# EAGLE design Discrete Datalogger ECU rev1 (EAGLE 8.6.0)
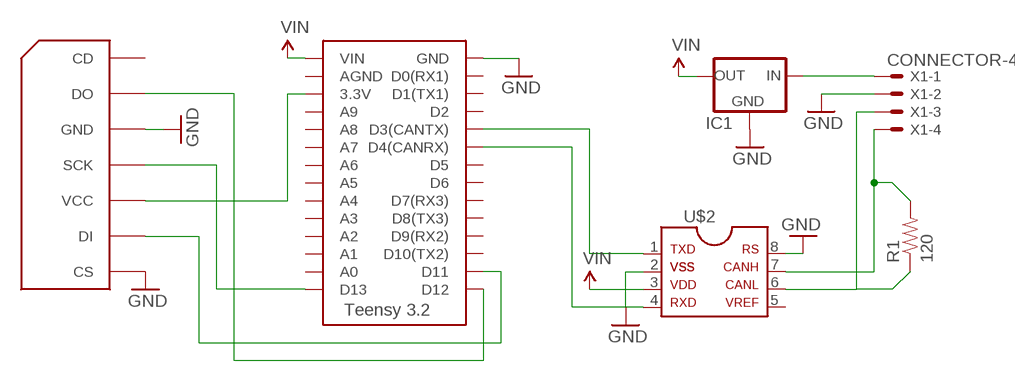
[diagram p0: schematic, sheet 1]

## Parts
IC1  5VREG_L7805_VERT  [TO-220]
R1  120  RESISTORAXIAL-0.3  [AXIAL-0.3]
U$1  TEENSY_3.2_SIMPLE  [TEENSY_3.2_SIMPLE]
U$2  MCP2551DIL  [DIL08]
U$3  SDCARD_INTERFACE  [SDCARD_INTERFACE]
X1  CONNECTOR-4  [MINIFIT_5566-4]

## Nets
GND: IC1.2(GND) U$1.GND U$2.2 U$2.8 U$3.CS U$3.GND X1.2
N$1: IC1.1(IN) X1.1
N$2: R1.P$2 U$2.7 X1.4
N$3: R1.P$1 U$2.6 X1.3
N$4: U$1.D3(CANTX) U$2.1
N$5: U$1.D4(CANRX) U$2.4
N$6: U$1.D13 U$3.SCK
N$7: U$1.D11 U$3.DI
N$8: U$1.3.3V U$3.VCC
N$9: U$1.D12 U$3.DO
VIN: IC1.3(OUT) U$1.VIN U$2.3
Unconnected: U$1.A0 U$1.A1 U$1.A2 U$1.A3 U$1.A4 U$1.A5 U$1.A6 U$1.A7 U$1.A8 U$1.A9 U$1.AGND U$1.D0(RX1) U$1.D1(TX1) U$1.D2 U$1.D5 U$1.D6 U$1.D7(RX3) U$1.D8(TX3) U$1.D9(RX2) U$1.D10(TX2) U$2.5 U$3.CD

## Library data of the parts
IC1 = HyTechDevices:5VREG_L7805: Voltage Regulator Switching 5v regulator Datasheet <http://power.murata.com/data/power/oki-78sr.pdf> Standard 7805 5V regulator. IGO (Input Ground Output). Spark Fun Electronics SKU : COM-00107 Datasheet <http://www.mouser.com/ds/2/308/MC7800-D-94905.pdf>
R1 = HyTechDevices:RESISTOR: Resistor Basic schematic elements and footprints for 0603, 1206, and PTH resistors.
U$1 = HyTechDevices:TEENSY_3.2_SIMPLE: Simple version of the Teensy 3.2 board that only uses the 2 main rows of pins, not the inner pins or the pins opposite the usb port.
U$2 = HyTechDevices:MCP2551: MCP2551 High-Speed CAN Transceiver Product Webpage <https://www.microchip.com/wwwproducts/en/MCP2551> Datasheet <http://ww1.microchip.com/downloads/en/DeviceDoc/21667f.pdf> This device is outdated It is replaced by MCP2561. Comparison Page <https://www.microchip.com/wwwproducts/ProductCompare/MCP2551/MCP2561> Product Webpage <https://www.microchip.com/wwwproducts/en/MCP2561> Datasheet <http://ww1.microchip.com/downloads/en/DeviceDoc/20005167C.pdf>
U$3 = HyTechDevices:SDCARD_INTERFACE
X1 = HyTechDevices:CONNECTOR-4: Mini-Fit Junior connector 4 pole Source: http://www.molex.com; OC_FARNELL: unknown; OC_NEWARK: unknown

## Board
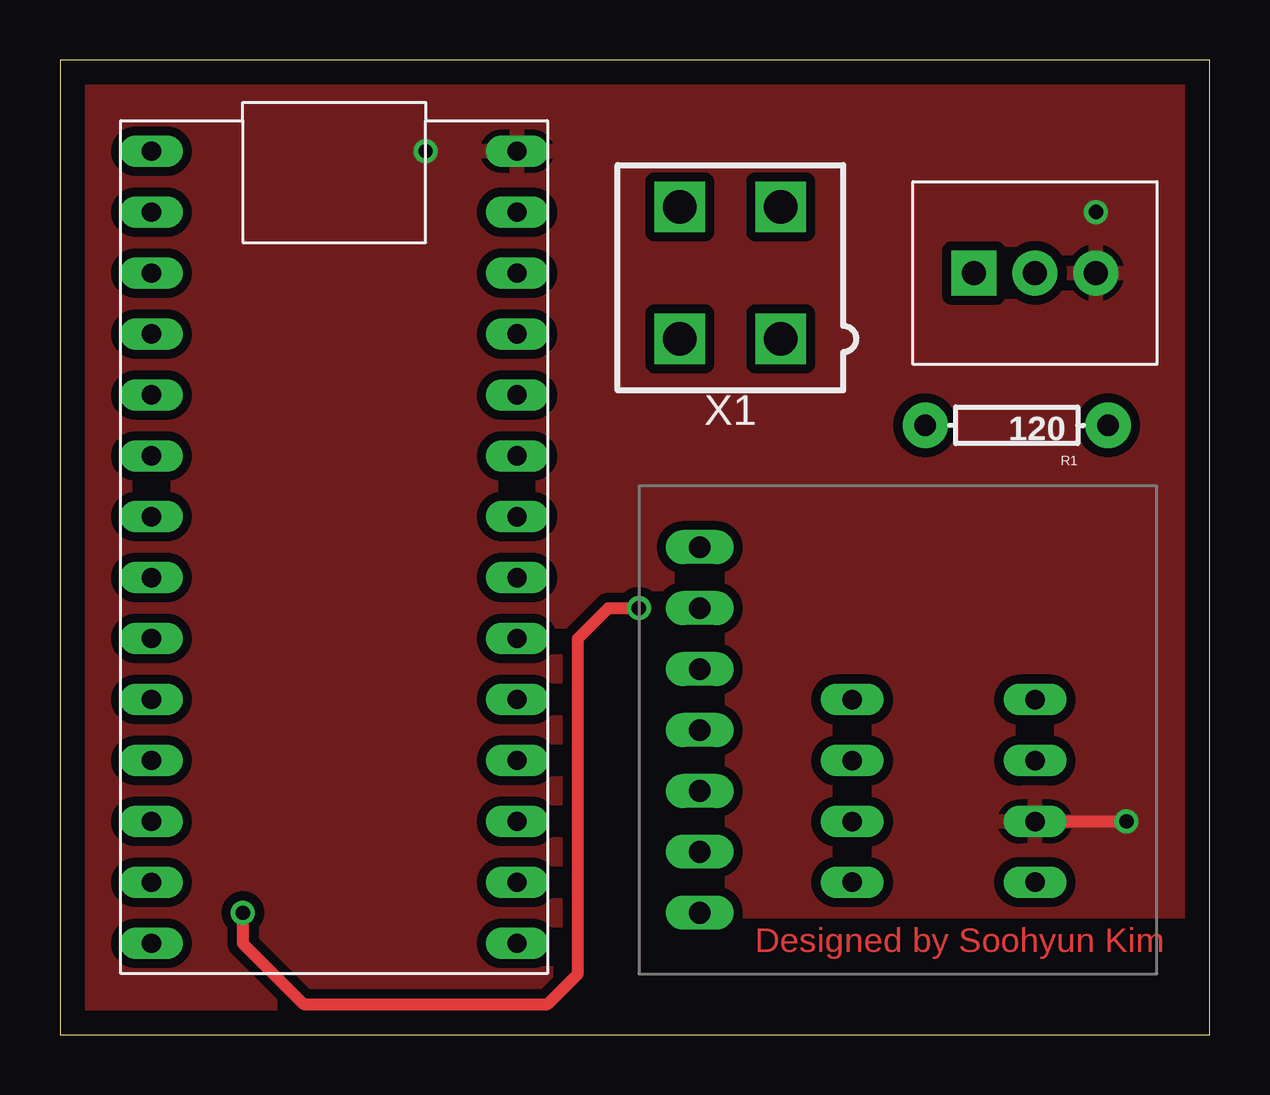
[diagram p1: board, top side]
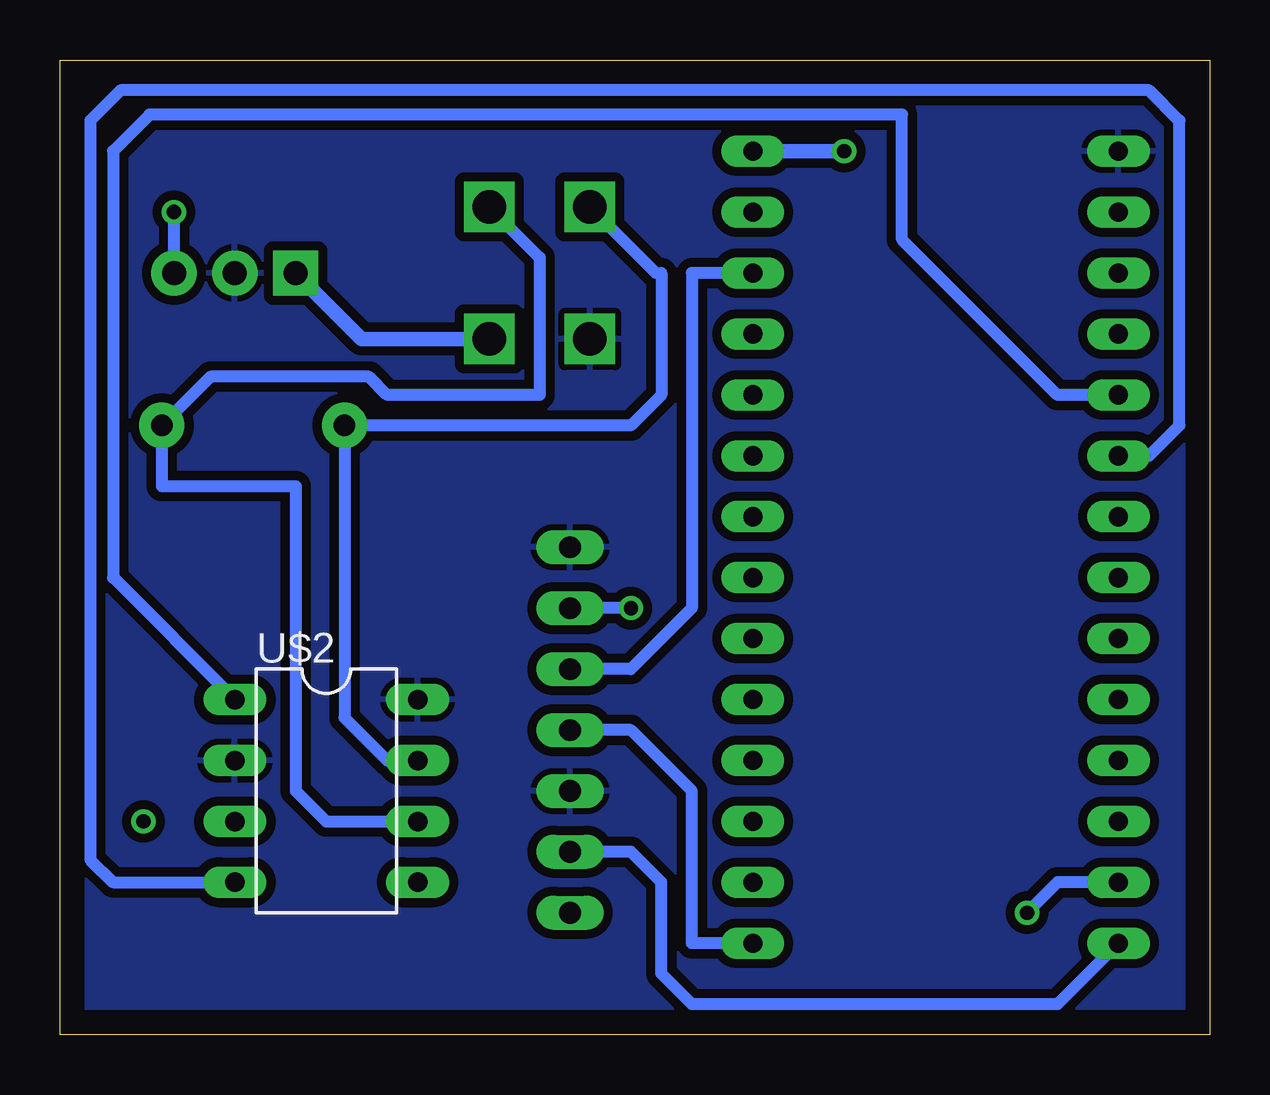
[diagram p2: board, bottom side, seen from below]

Size 47.93 x 40.63 mm. Coordinates in mm from the lower left corner, seen from the top.
Outline: 0,0 47.93,0 47.93,40.63 0,40.63 0,0
Copper layers (1*16): Top 0.035mm / dielectric 1.5mm / Bottom 0.035mm
Design rules "default *": minimum track width 6mil, minimum drill 0.35mm, track to track 15mil, track to pad 15mil, pad to pad 15mil, via to via 15mil, smd to smd 6mil, copper to edge 40mil, drill to drill 6mil, minimum pad ring 10mil, minimum via ring 8mil, stop-mask expansion 4mil, vias tented up to drill 0mil, thermal gap 10mil

### Footprints (pad centres in the part's own frame; a part is rotated, then mirrored left to right if it is on the bottom)
TO-220 = drill 1 pad 1.88 square: 1 -2.54,0 | drill 1 pad 1.88: 2 0,0; 3 2.54,0
AXIAL-0.3 = drill 0.9 pad 1.88: P$1 -3.81,0; P$2 3.81,0
TEENSY_3.2_SIMPLE = drill 0.8 long: 3.3V 16.51,29.21; A0 16.51,3.81; A1 16.51,6.35; A2 16.51,8.89; A3 16.51,11.43; A4 16.51,13.97; A5 16.51,16.51; A6 16.51,19.05; A7 16.51,21.59; A8 16.51,24.13; A9 16.51,26.67; AGND 16.51,31.75; D0(RX1) 1.27,31.75; D1(TX1) 1.27,29.21; D2 1.27,26.67; D3(CANTX) 1.27,24.13; D4(CANRX) 1.27,21.59; D5 1.27,19.05; D6 1.27,16.51; D7(RX3) 1.27,13.97; D8(TX3) 1.27,11.43; D9(RX2) 1.27,8.89; D10(TX2) 1.27,6.35; D11 1.27,3.81; D12 1.27,1.27; D13 16.51,1.27; GND 1.27,34.29; VIN 16.51,34.29
DIL08 = drill 0.813 long: 1 -3.81,-3.81; 2 -1.27,-3.81; 3 1.27,-3.81; 4 3.81,-3.81; 5 3.81,3.81; 6 1.27,3.81; 7 -1.27,3.81; 8 -3.81,3.81
SDCARD_INTERFACE = drill 0.9 long: CD 2.54,0; CS 2.54,-15.24; DI 2.54,-12.7; DO 2.54,-2.54; GND 2.54,-5.08; SCK 2.54,-7.62; VCC 2.54,-10.16
MINIFIT_5566-4 = drill 1.4 square: 1 2.1,-2.75; 2 -2.1,-2.75; 3 2.1,2.75; 4 -2.1,2.75

### Placement (x,y rotation side)
IC1  40.64,31.75 0 top
R1  39.88,25.4 180 top
U$1  2.54,2.54 0 top
U$2  36.83,10.16 270 bottom
U$3  29.21,5.08 180 top
X1  27.94,31.75 0 top

### Tracks (layer width: path | path; a pad name or v marks a point on that pad's centre or on a via)
GND
  pour Bottom: 0,40.64 48.26,40.64 48.26,0 0,0
N$1
  Bottom 0.61: X1.1 35.35,29 IC1.1
N$2
  Bottom 0.508: X1.4 23.09,31.75 22.86,31.75 22.86,26.67 24.13,25.4 R1.P$2 36.07,13.21 34.29,11.43 U$2.7
N$3
  Bottom 0.508: X1.3 27.94,32.4 27.94,26.67 34.29,26.67 35.05,27.43 41.66,27.43 R1.P$1 43.69,22.86 38.1,22.86 38.1,10.16 36.83,8.89 U$2.6
N$4
  Bottom 0.508: U$1.D3(CANTX) 6.35,26.67 12.83,33.15 12.83,38.35 44.2,38.35 45.72,36.83 45.72,19.05 U$2.1
N$5
  Bottom 0.508: U$1.D4(CANRX) 2.54,24.13 1.27,25.4 1.27,38.1 2.53,39.36 45.4,39.36 46.66,38.1 46.66,7.29 45.72,6.35 U$2.4
N$6
  Bottom 0.508: U$1.D13 21.59,3.81 21.59,10.16 24.13,12.7 U$3.SCK
N$7  (via drill 0.6)
  Top 0.508: v7.62,5.08 7.62,3.81 10.16,1.27 20.32,1.27 21.59,2.54 21.59,16.51 22.86,17.78 v24.13,17.78
  Bottom 0.305: U$1.D11 5.08,6.35
  Bottom 0.508: U$1.D11 6.35,6.35 v7.62,5.08 | v24.13,17.78 U$3.DI
N$8
  Bottom 0.508: U$1.3.3V 21.59,31.75 21.59,17.78 24.13,15.24 U$3.VCC
N$9
  Bottom 0.508: U$1.D12 6.35,1.27 21.59,1.27 22.86,2.54 22.86,6.35 24.13,7.62 U$3.DO
VIN  (via drill 0.6)
  Top 0.508: U$2.3 v44.45,8.89
  Bottom 0.508: IC1.3 v43.18,34.29
  Bottom 0.61: U$1.VIN v15.24,36.83
  pour Top: 0,40.64 48.26,40.64 48.26,0 0,0

### Text on the board
Top: Designed by Soohyun Kim
tDocu: Designed by Soohyun Kim